# Altium project Cubli.PrjPcb (part 2 of 2)

## Sheet Power.SchDoc
size B; DocumentNumber: 4; SheetNumber: 2; SheetTotal: 7
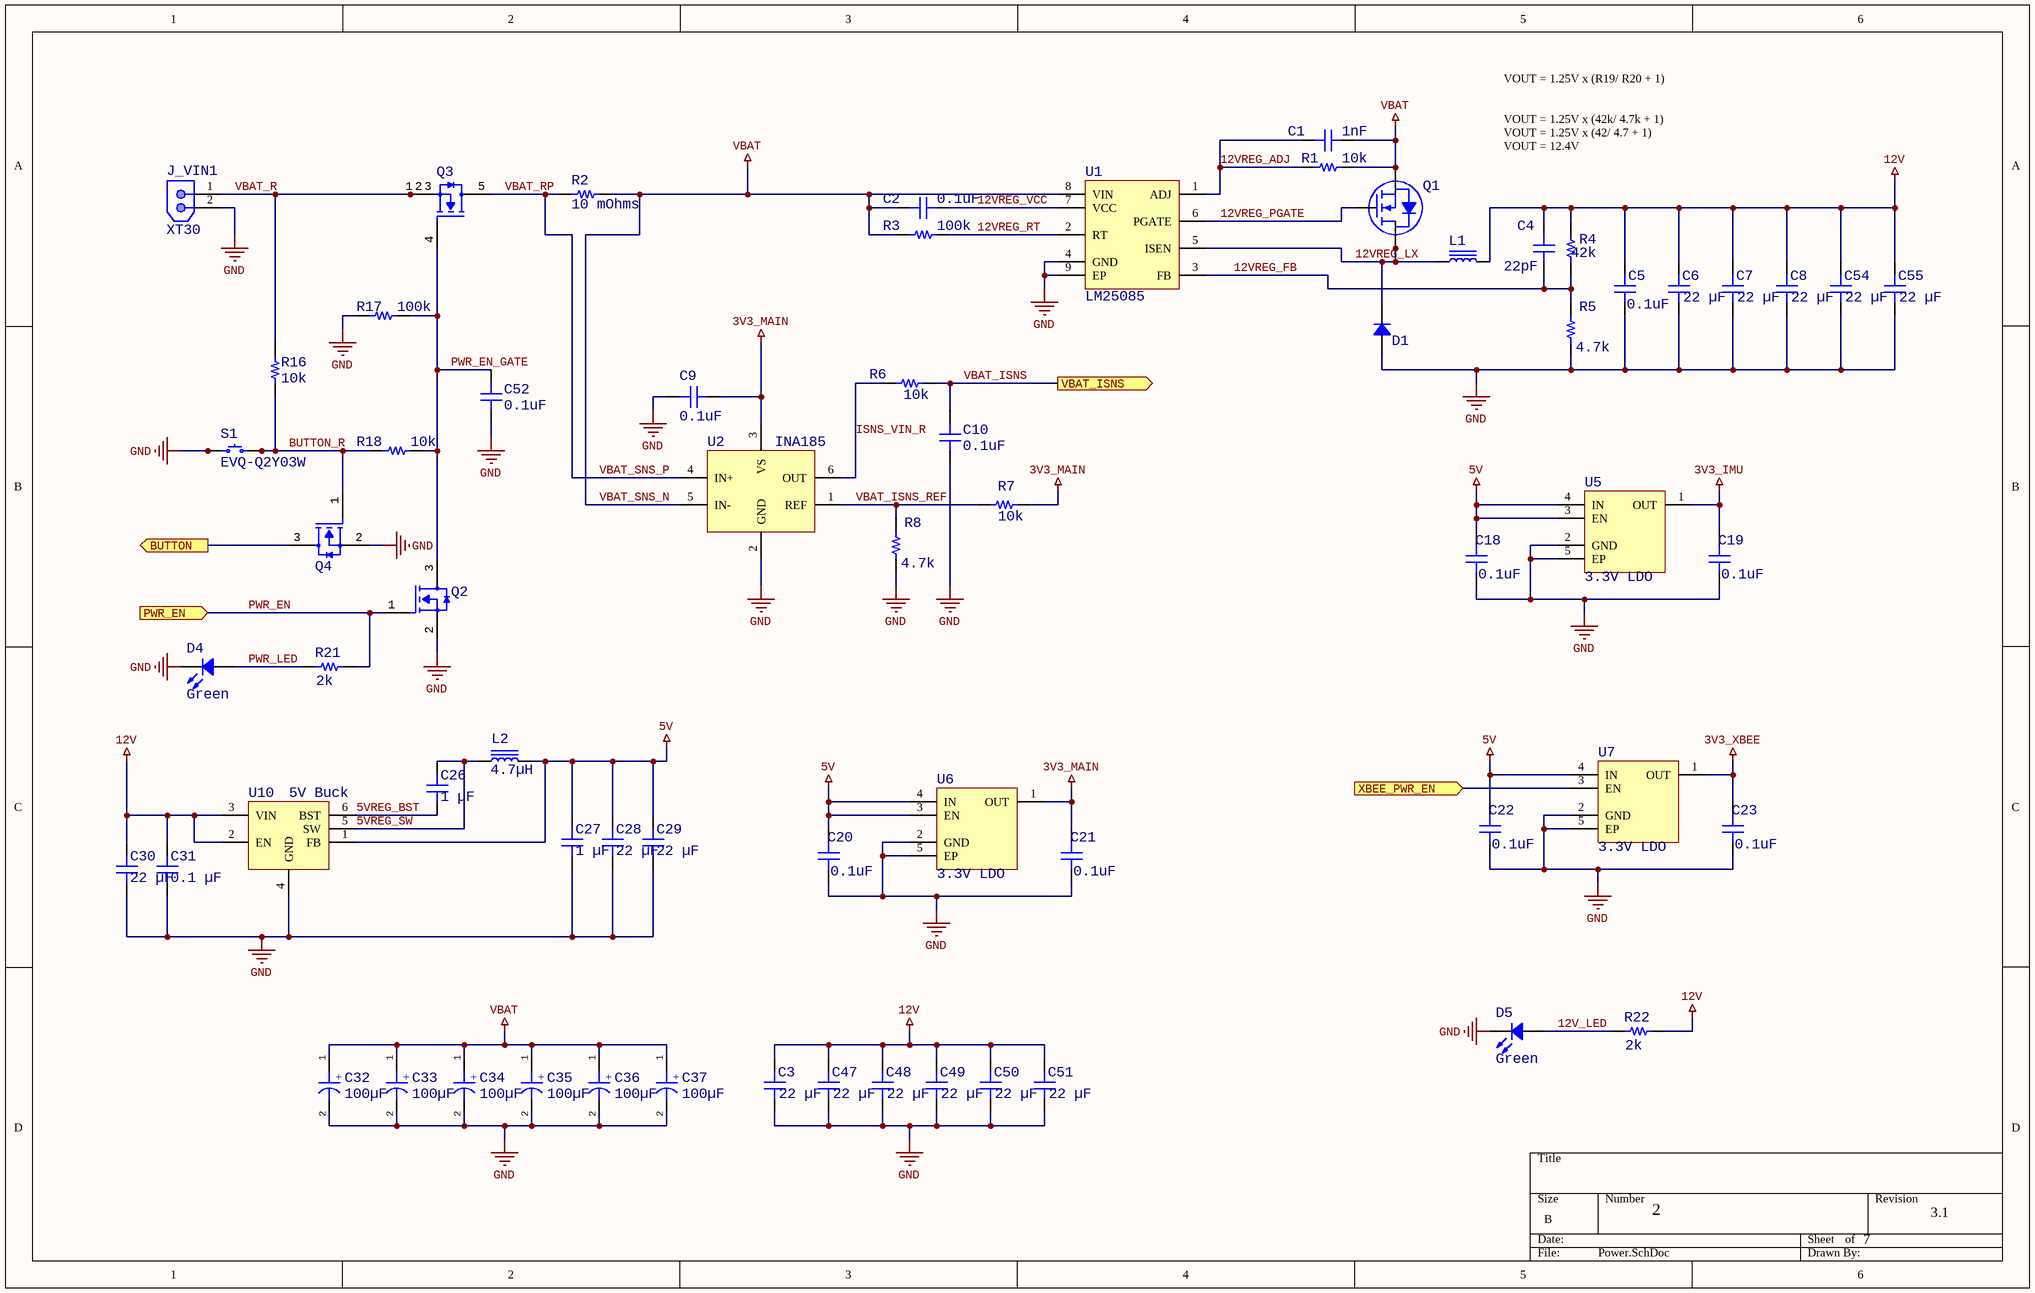
[diagram p6: Power.SchDoc]

### Parts
C1  1nF  [CAP_0402]
C2  0.1uF  [CAP_0402]
C3  22 µF  [CAP 0805_2012]
C4  22pF  [CAP_0402]
C5  0.1uF  [CAP_0402]
C6  22 µF  [CAP 0805_2012]
C7  22 µF  [CAP 0805_2012]
C8  22 µF  [CAP 0805_2012]
C9  0.1uF  [CAP_0402]
C10  0.1uF  [CAP_0402]
C18  0.1uF  [CAP_0402]
C19  0.1uF  [CAP_0402]
C20  0.1uF  [CAP_0402]
C21  0.1uF  [CAP_0402]
C22  0.1uF  [CAP_0402]
C23  0.1uF  [CAP_0402]
C26  1 µF  [CAP 0402_1005]
C27  1 µF  [CAP 0402_1005]
C28  22 µF  [CAP 0603_1608]
C29  22 µF  [CAP 0603_1608]
C30  22 µF  [CAP 0603_1608]
C31  0.1 µF  [CAP 0402_1005]
C32  value 100µF  [UWZ1V101MCL1GS]  (hidden comment: UWZ1V101MCL1GS)
C33  value 100µF  [UWZ1V101MCL1GS]  (hidden comment: UWZ1V101MCL1GS)
C34  value 100µF  [UWZ1V101MCL1GS]  (hidden comment: UWZ1V101MCL1GS)
C35  value 100µF  [UWZ1V101MCL1GS]  (hidden comment: UWZ1V101MCL1GS)
C36  value 100µF  [UWZ1V101MCL1GS]  (hidden comment: UWZ1V101MCL1GS)
C37  value 100µF  [UWZ1V101MCL1GS]  (hidden comment: UWZ1V101MCL1GS)
C47  22 µF  [CAP 0805_2012]
C48  22 µF  [CAP 0805_2012]
C49  22 µF  [CAP 0805_2012]
C50  22 µF  [CAP 0805_2012]
C51  22 µF  [CAP 0805_2012]
C52  0.1uF  [CAP_0402]
C54  22 µF  [CAP 0805_2012]
C55  22 µF  [CAP 0805_2012]
D1  SE10FGHM3/H  [SMF DO-219AB]  (value not drawn)
D4  Green  [LED 0603_1608 GREEN]
D5  Green  [LED 0603_1608 GREEN]
J_VIN1  XT30  [XT30]
L1  MPL-AL5050-5R6  [MPL-AL5050-5R6]  (value not drawn)
L2  4.7µH  [IND 1008_2520]
Q1  NVTFS5C680NL  [NVTFS015N04CTAG]  (value not drawn)
Q2  DMN61D9UWQ-7  [DMN61D9UWQ-7]  (value not drawn)
Q3  STL220N6F7  [STL220N6F7]  (value not drawn)
Q4  DMN61D9UWQ-7  [DMN61D9UWQ-7]  (value not drawn)
R1  10k  [RES_0402]
R2  10 mOhms  [RES 1206_3216]
R3  100k  [RES_0402]
R4  42k  [RES_0402]
R5  4.7k  [RES_0402]
R6  10k  [RES_0402]
R7  10k  [RES_0402]
R8  4.7k  [RES_0402]
R16  10k  [RES_0402]
R17  100k  [RES_0402]
R18  10k  [RES_0402]
R21  2k  [RES_0402]
R22  2k  [RES_0402]
S1  EVQ-Q2Y03W  [PANASONIC EVQQ2]
U1  LM25085  [8-WSON_3x3_0.5mm]
U2  INA185  [TI SC70-6 DCK]
U5  3.3V LDO  [XDFN-4]
U6  3.3V LDO  [XDFN-4]
U7  3.3V LDO  [XDFN-4]
U10  5V Buck  [TSOT-26-6 - 3.2mm]

### Ports
BUTTON (out), PWR_EN (in), VBAT_ISNS (out), XBEE_PWR_EN (in)

### Nets
3V3_IMU: C19.2 U5.1(OUT)
3V3_MAIN: C9.1 C21.2 R7.1 U2.3(VS) U6.1(OUT)
3V3_XBEE: C23.2 U7.1(OUT)
5V: C18.2 C20.2 C22.2 C27.2 C28.2 C29.2 L2.2 U5.3(EN) U5.4(IN) U6.3(EN) U6.4(IN) U7.4(IN) U10.1(FB)
12V: C3.2 C4.2 C5.2 C6.2 C7.2 C8.2 C30.2 C31.2 C47.2 C48.2 C49.2 C50.2 C51.2 C54.2 C55.2 L1.2 R4.1 R22.2 U10.2(EN) U10.3(VIN)
GND: C3.1 C5.1 C6.1 C7.1 C8.1 C9.2 C10.2 C18.1 C19.1 C20.1 C21.1 C22.1 C23.1 C27.1 C28.1 C29.1 C30.1 C31.1 C32.2 C33.2 C34.2 C35.2 C36.2 C37.2 C47.1 C48.1 C49.1 C50.1 C51.1 C52.2 C54.1 C55.1 D1.1 D4.2 D5.2 J_VIN1.2 Q2.2(SOURCE) Q4.2(SOURCE) R5.2 R8.2 R17.2 S1.1 S1.2 U1.4(GND) U1.9(EP) U2.2(GND) U5.2(GND) U5.5(EP) U6.2(GND) U6.5(EP) U7.2(GND) U7.5(EP) U10.4(GND)
VBAT: C1.2 C2.1 C32.1 C33.1 C34.1 C35.1 C36.1 C37.1 Q1.1(S) Q1.2(S) Q1.3(S) R1.1 R2.2 R3.2 U1.8(VIN) U2.5(IN-)  [also labelled VBAT_SNS_N]
5VREG_BST: C26.1 U10.6(BST)
5VREG_SW: C26.2 L2.1 U10.5(SW)
12V_LED: D5.1 R22.1
12VREG_ADJ: C1.1 R1.2 U1.1(ADJ)
12VREG_FB: C4.1 R4.2 R5.1 U1.3(FB)
12VREG_LX: D1.2 L1.1 Q1.5(D) Q1.6(D) Q1.7(D) Q1.8(D) U1.5(ISEN)
12VREG_PGATE: Q1.4(G) U1.6(PGATE)
12VREG_RT: R3.1 U1.2(RT)
12VREG_VCC: C2.2 U1.7(VCC)
BUTTON_IN: Q4.3(DRAIN) ; port BUTTON
BUTTON_R: Q4.1(GATE) R16.2 R18.2 S1.3 S1.4
ISNS_VIN_R: R6.2 U2.6(OUT)
PWR_EN: Q2.1(GATE) R21.2 ; port PWR_EN
PWR_EN_GATE: C52.1 Q2.3(DRAIN) Q3.4(GATE) R17.1 R18.1
PWR_LED: D4.1 R21.1
VBAT_ISNS: C10.1 R6.1 ; port VBAT_ISNS
VBAT_ISNS_REF: R7.2 R8.1 U2.1(REF)
VBAT_R: J_VIN1.1 Q3.1(SOURCE) Q3.2(SOURCE) Q3.3(SOURCE) R16.1
VBAT_RP: Q3.5(DRAIN) R2.1 U2.4(IN+)  [also labelled VBAT_SNS_P]
XBEE_PWR_EN: U7.3(EN) ; port XBEE_PWR_EN

### Notes on the sheet
- VOUT = 1.25V x (R19/ R20 + 1)
- VOUT = 1.25V x (42k/ 4.7k + 1)
  VOUT = 1.25V x (42/ 4.7 + 1)
  VOUT = 12.4V
- (in symbol CMP-001-00099-2) +

### Library data of the parts
C1 C2 C4 C5 C9 C10 C18-C23 C52 = CAP_0402: CAP CER 402
  C1: Value: 1nF
  C2 C5 C9 C10 C18-C23 C52: Value: 0.1uF
  C4: Value: 22pF
C3 C6-C8 C47-C51 C54 C55 = KGM21AS61C226MU: CAP CER 22UF 16V X6S 0805; manufacturer: KYOCERA AVX; Tolerance: ±20%; Part Number: KGM21AS61C226MU; Value: 22 µF; Applications: General Purpose; Capacitance: 22 µF; componentlink1description: Datasheet; componentlink1url: https://media.digikey.com/pdf/Data%20Sheets/AVX%20PDFs/CM03_CM05_CM105_CM21_CM316_Spec.pdf; componentlink2description: DigiKey Link; componentlink2url: https://www.digikey.com/en/products/detail/kyocera-avx/KGM21AS61C226MU/17827473; Device Package: 0805 (2012 Metric); lastupdated: 2/9/2024 8:14:12 PM; Lifecycle Status: Active; Minimum Order: 1; Mounting Type: Surface Mount, MLCC; Operating Temperature: -55°C ~ 105°C; Package / Case: 0805 (2012 Metric); packaging: TapeAndReel; partid: 52516; Part Status: Active; price: 0.12; series: KGM - X6S; Size / Dimension: 0.079" L x 0.049" W (2.01mm x 1.25mm); Supplier 1: DigiKey; Supplier Part Number 1: 478-KGM21AS61C226MUCT-ND; Temperature Coefficient: X6S; Thickness (Max): 0.057" (1.45mm); Voltage - Rated: 16V
C26 C27 = C0402C104K4RACAUTO: CAP CER 0.1UF 16V X7R 0402; manufacturer: KEMET; Capacitance: 0.1 µF; Tolerance: ±10%; Part Number: C0402C104K4RACAUTO; Value: 1 µF; Applications: Automotive, Bypass, Decoupling; componentlink1description: Datasheet; componentlink1url: https://api.kemet.com/component-edge/download/specsheet/C0402C104K4RACAUTO.pdf; componentlink2description: DigiKey Link; componentlink2url: https://www.digikey.com/en/products/detail/kemet/C0402C104K4RACAUTO/3314827; Device Package: 0402 (1005 Metric); lastupdated: 2/9/2024 8:04:35 PM; Lifecycle Status: Active; Minimum Order: 1; Mounting Type: Surface Mount, MLCC; Operating Temperature: -55°C ~ 125°C; Package / Case: 0402 (1005 Metric); packaging: TapeAndReel; partid: 3024; Part Status: Active; price: 0.01; Ratings: AEC-Q200; series: SMD Auto X7R; Size / Dimension: 0.039" L x 0.020" W (1.00mm x 0.50mm); Supplier 1: DigiKey; Supplier Part Number 1: 399-6828-1-ND; Temperature Coefficient: X7R; Thickness (Max): 0.022" (0.55mm); Voltage - Rated: 16V
C28-C30 = C0603B476M007T: CAP CER 47UF 6.3V X5R 0603; manufacturer: Holy Stone Enterprise Co., Ltd.; Capacitance: 47 µF; Tolerance: ±20%; Part Number: C0603B476M007T; Value: 22 µF; Applications: SMPS Filtering; componentlink1description: Datasheet; componentlink1url: https://media.digikey.com/pdf/Data%20Sheets/Holy%20Stone/HCC_Series_DS.pdf; componentlink2description: DigiKey Link; componentlink2url: https://www.digikey.com/en/products/detail/holy-stone-enterprise-co-ltd/C0603B476M007T/16895203; Device Package: 0603 (1608 Metric); lastupdated: 2/9/2024 8:09:41 PM; Lifecycle Status: Active; Minimum Order: 1; Mounting Type: Surface Mount, MLCC; Operating Temperature: -55°C ~ 85°C; Package / Case: 0603 (1608 Metric); packaging: TapeAndReel; partid: 48531; Part Status: Active; price: 0.12; series: HCC; Size / Dimension: 0.063" L x 0.031" W (1.60mm x 0.80mm); Supplier 1: DigiKey; Supplier Part Number 1: 4587-C0603B476M007TCT-ND; Temperature Coefficient: X5R; Thickness (Max): 0.039" (1.00mm); Voltage - Rated: 6.3V
C31 = C0402C104K4RACAUTO: CAP CER 0.1UF 16V X7R 0402; manufacturer: KEMET; Tolerance: ±10%; Part Number: C0402C104K4RACAUTO; Value: 0.1 µF; Applications: Automotive, Bypass, Decoupling; Capacitance: 0.1 µF; componentlink1description: Datasheet; componentlink1url: https://api.kemet.com/component-edge/download/specsheet/C0402C104K4RACAUTO.pdf; componentlink2description: DigiKey Link; componentlink2url: https://www.digikey.com/en/products/detail/kemet/C0402C104K4RACAUTO/3314827; Device Package: 0402 (1005 Metric); lastupdated: 2/9/2024 8:04:35 PM; Lifecycle Status: Active; Minimum Order: 1; Mounting Type: Surface Mount, MLCC; Operating Temperature: -55°C ~ 125°C; Package / Case: 0402 (1005 Metric); packaging: TapeAndReel; partid: 3024; Part Status: Active; price: 0.01; Ratings: AEC-Q200; series: SMD Auto X7R; Size / Dimension: 0.039" L x 0.020" W (1.00mm x 0.50mm); Supplier 1: DigiKey; Supplier Part Number 1: 399-6828-1-ND; Temperature Coefficient: X7R; Thickness (Max): 0.022" (0.55mm); Voltage - Rated: 16V
C32-C37 = CMP-001-00099-2: Aluminum Electrolytic Capacitor, Polarized, Aluminum (wet), 35V, 20% +Tol, 20% -Tol, 100uF, Surface Mount, 2626; Capacitor Type: Aluminium; AECQ: Yes; Ripple Current: 84mA; Case/Package: 6.60mm x 6.60mm; Voltage Rating: 35V; Min Operating Temperature: -55°C; Mounting Technology: Surface Mount; Max Operating Temperature: 105°C; RoHS Compliant: Yes; Pins: 2
D1 = SE10FGHM3/H: DIODE GEN PURP 400V 1A DO219AB; Manufacturer: Vishay Semiconductor Diodes Division; Capacitance @ Vr, F: 7.5pF @ 4V, 1MHz; Current - Reverse Leakage @ Vr: 5µA @ 400V; Diode Type: Standard; Reverse Recovery Time (trr): 780ns; Speed: Standard Recovery >500ns, > 200mA (Io); Voltage - Forward (Vf) (Max) @ If: 1.05V @ 1A; Part Number: SE10FGHM3/H; ComponentLink1Description: Datasheet; ComponentLink1URL: http://www.vishay.com/docs/87722/se10fd-se10fg-se10fj.pdf; ComponentLink2Description: DigiKey Link; ComponentLink2URL: http://digikey.com/product-detail/en/vishay-semiconductor-diodes-division/SE10FGHM3-H/SE10FGHM3-HGICT-ND/8565217; Current - Average Rectified (Io): 1A; LastUpdated: 6/3/2024 8:05:29 PM; Lifecycle Status: Active; Minimum Order: 1; Mounting Type: Surface Mount; Operating Temperature - Junction: -55°C ~ 175°C; Package / Case: DO-219AB; Packaging: TapeAndReel; PartId: 1227; Part Status: Active; Price: 0.10; Series: Automotive, AEC-Q101; Supplier 1: DigiKey; Supplier Part Number 1: SE10FGHM3/HGICT-ND; Supplier Device Package: DO-219AB (SMF); Voltage - DC Reverse (Vr) (Max): 400V
D4 D5 = XZCDGK53W-8VF: LED GREEN CLEAR 2SMD; Manufacturer: SunLED; Configuration: Independent; Current - Test: 2mA; Lens Color: Colorless; Lens Size: 0.35mm Dia; Lens Style: Round with Domed Top; Millicandela Rating: 417mcd; Viewing Angle: 60°; Voltage - Forward (Vf) (Typ): 2.65V; Wavelength - Dominant: 525nm; Wavelength - Peak: 515nm; Part Number: XZCDGK53W-8VF; Color: Green; ComponentLink1Description: Datasheet; ComponentLink1URL: https://www.sunledusa.com/products/spec/XZCDGK53W-8VF.pdf; ComponentLink2Description: DigiKey Link; ComponentLink2URL: https://www.digikey.com/en/products/detail/sunled/XZCDGK53W-8VF/10449775; Device Package: 0603 (1608 Metric); Height (Max): 1.10mm; LastUpdated: 6/3/2024 7:58:52 PM; Lens Transparency: Clear; Lifecycle Status: Active; Minimum Order: 1; Mounting Type: Surface Mount; Package / Case: 0603 (1608 Metric); Packaging: TapeAndReel; PartId: 938; Part Status: Active; Price: 0.15; Series: Ultra Low Current; Size / Dimension: 1.60mm L x 0.80mm W; Supplier 1: DigiKey; Supplier Part Number 1: 1497-XZCDGK53W-8VFCT-ND; Supplier Device Package: 2-SMD; Value: Green
L1 = MPL-AL5050-5R6: FIXED IND 5.6UH 6.8A 20 MOHM SMD; MF: Laird-Signal Integrity Products; MP: MGV05021R0M-10; SnapEDA_Link: https://www.snapeda.com/parts/MGV05021R0M-10/Laird/view-part/5881352/?ref=snap; Availability: In Stock; Purchase-URL: https://pricing.snapeda.com/search/part/MGV05021R0M-10/?ref=eda; Check_prices: https://www.snapeda.com/parts/MGV05021R0M-10/Laird/view-part/5881352/?ref=eda; Value: *; Package: Molded-2 Laird; Price: None
L2 = MLP2520S4R7ST0S1: FIXED IND 4.7UH 1A 110 MOHM SMD; Manufacturer: TDK Corporation; DC Resistance (DCR): 143mOhm Max; Inductance Frequency - Test: 2MHz; Material - Core: Ferrite; Shielding: Shielded; Tolerance: ±20%; Type: Multilayer; Part Number: MLP2520S4R7ST0S1; ComponentLink1Description: Datasheet; ComponentLink1URL: https://product.tdk.com/info/en/catalog/datasheets/inductor_commercial_power_mlp2520_en.pdf?ref_disty=digikey; ComponentLink2Description: DigiKey Link; ComponentLink2URL: http://digikey.com/product-detail/en/tdk-corporation/MLP2520S4R7ST0S1/445-6378-1-ND/2465705; Current Rating (Amps): 1A; Device Package: 1008 (2520 Metric); Height - Seated (Max): 0.039" (1.00mm); Inductance: 4.7µH; LastUpdated: 9/2/2020 1:29:23 AM; Lifecycle Status: Active; Minimum Order: 1; Mounting Type: Surface Mount; Operating Temperature: -40°C ~ 125°C; Package / Case: 1008 (2520 Metric); Packaging: TapeAndReel; PartId: 3467; Part Status: Active; Price: 0.14; Series: MLP; Size / Dimension: 0.098" L x 0.079" W (2.50mm x 2.00mm); Supplier 1: DigiKey; Supplier Part Number 1: 445-6378-1-ND; Supplier Device Package: 1008 (2520 Metric); Value: 4.7µH
Q1 = NVTFS5C680NL: N-FET
Q2 Q4 = CMP-013-00037-2: Small Signal Field-Effect Transistor; Transistor Type: n-FET; Min Operating Temperature: -55°C; Max Operating Temperature: 175°C; RoHS Compliant: Yes
Q3 = CMP-013-00035-1: Power Field-Effect Transistor, 120A I(D), 60V, 0.0014ohm, 1-Element, N-Channel, Silicon, Metal-oxide Semiconductor FET; Transistor Type: n-FET; Power: 4.8W; Min Operating Temperature: -55°C; Pins: 8; Case/Package: 8-PowerVDFN; RoHS Compliant: Yes; Max Operating Temperature: 175°C
R1 R3-R8 R16-R18 R21 R22 = RES_0402: RES 0402
R2 = KRL1632E-M-R039-F-T5: RES 0.039 OHM 1% 3/4W 1206; Manufacturer: Susumu; Power (Watts): 0.75W, 3/4W; Resistance: 39 mOhms; Temperature Coefficient: ±50ppm/°C; Value: 39 mOhms; Part Number: KRL1632E-M-R039-F-T5; ComponentLink1Description: Datasheet; ComponentLink1URL: http://www.susumu.co.jp/common/pdf/n_catalog_partition09_en.pdf; ComponentLink2Description: DigiKey Link; ComponentLink2URL: https://www.digikey.com/en/products/detail/susumu/KRL1632E-M-R039-F-T5/3738003; Composition: Metal Foil; Device Package: 1206 (3216 Metric); Features: Automotive AEC-Q200, Current Sense; Height - Seated (Max): 0.028" (0.70mm); LastUpdated: 2/9/2024 8:54:46 PM; Lifecycle Status: Active; Minimum Order: 1; Number of Terminations: 2; Operating Temperature: -55°C ~ 155°C; Package / Case: 1206 (3216 Metric); Packaging: TapeAndReel; PartId: 26838; Part Status: Active; Price: 0.09; Ratings: AEC-Q200; Series: KRL; Size / Dimension: 0.126" L x 0.063" W (3.20mm x 1.60mm); Supplier 1: DigiKey; Supplier Part Number 1: 408-1577-1-ND; Supplier Device Package: 1206; Tolerance: ±1%
S1 = EVQ-Q2Y03W: SWITCH TACTILE SPST-NO 0.02A 15V; Manufacturer: Panasonic Electronic Components; Actuator Height off PCB, Vertical: 3.10mm; Actuator Orientation: Top Actuated; Actuator Type: Standard; Contact Rating @ Voltage: 0.02A @ 15VDC; Illumination: Non-Illuminated; Operating Force: 350gf; Outline: 6.50mm x 6.00mm; Switch Function: Off-Mom; Part Number: EVQ-Q2Y03W; Circuit: SPST-NO; ComponentLink1Description: Datasheet; ComponentLink1URL: https://industrial.panasonic.com/ac/cdn/e/control/switch/light-touch/catalog/sw_lt_eng_6s_th.pdf; ComponentLink2Description: DigiKey Link; ComponentLink2URL: http://digikey.com/product-detail/en/panasonic-electronic-components/EVQ-Q2Y03W/P12961SCT-ND/762951; LastUpdated: 4/9/2020 9:55:13 AM; Lifecycle Status: Active; Minimum Order: 1; Mounting Type: Surface Mount; Operating Temperature: -40°C ~ 85°C; Packaging: TapeAndReel; Part Status: Active; Price: 0.16; Series: EVQQ2; Supplier 1: DigiKey; Supplier Part Number 1: P12961SCT-ND; Termination Style: J Lead
U1 = LM25085: PFET Buck Controller
U2 = INA185: INA185A2
U5-U7 = TLV74033PDQNR
U10 = AP63205WU-7: 5V fixed step down Buck

## Nets that join several sheets
3V3_IMU: Top (10 pins), Power (C19.2 U5.1)
3V3_MAIN: Top (R9.1 R10.1 U9.5), Main_MCU (16 pins), Power (5 pins)
3V3_XBEE: Top (C25.1 U8.2), Power (C23.2 U7.1)
5V: Top (C24.1 J_I2C.1 U9.3), U_ESC1 (C26_ESC_1.1 R8_ESC_1.2 R38_ESC_1.2 U7_ESC_1.3), U_ESC1/U_Power (6 pins), U_ESC2 (C26_ESC_2.1 R8_ESC_2.2 R38_ESC_2.2 U7_ESC_2.3), U_ESC2/U_Power (6 pins), U_ESC3 (C26_ESC_3.1 R8_ESC_3.2 R38_ESC_3.2 U7_ESC_3.3), U_ESC3/U_Power (6 pins), Power (13 pins)
12V: U_ESC1/U_Half_Bridges (15 pins), U_ESC2/U_Half_Bridges (15 pins), U_ESC3/U_Half_Bridges (15 pins), Power (20 pins)
GND: Top (29 pins), U_ESC1 (23 pins), U_ESC1/U_ESC_MCU (20 pins), U_ESC1/U_Power (28 pins), U_ESC1/U_Half_Bridges (38 pins), U_ESC2 (23 pins), U_ESC2/U_ESC_MCU (20 pins), U_ESC2/U_Power (28 pins), U_ESC2/U_Half_Bridges (38 pins), U_ESC3 (23 pins), U_ESC3/U_ESC_MCU (20 pins), U_ESC3/U_Power (28 pins), U_ESC3/U_Half_Bridges (38 pins), Main_MCU (21 pins), Power (53 pins)
VBAT: Top (R23.1), U_ESC1/U_Power (R1_ESC_1.1 U1_ESC_1.4), U_ESC2/U_Power (R1_ESC_2.1 U1_ESC_2.4), U_ESC3/U_Power (R1_ESC_3.1 U1_ESC_3.4), Power (16 pins)
3V3_LOGIC_ESC_U_ESC1: U_ESC1 (R7_ESC_1.2), U_ESC1/U_Power (5 pins), U_ESC1/U_Half_Bridges (6 pins)
3V3_LOGIC_ESC_U_ESC2: U_ESC2 (R7_ESC_2.2), U_ESC2/U_Power (5 pins), U_ESC2/U_Half_Bridges (6 pins)
3V3_LOGIC_ESC_U_ESC3: U_ESC3 (R7_ESC_3.2), U_ESC3/U_Power (5 pins), U_ESC3/U_Half_Bridges (6 pins)
3V3_MCU_ESC_U_ESC1: U_ESC1 (8 pins), U_ESC1/U_ESC_MCU (15 pins), U_ESC1/U_Power (C12_ESC_1.2 U2_ESC_1.1)
3V3_MCU_ESC_U_ESC2: U_ESC2 (8 pins), U_ESC2/U_ESC_MCU (15 pins), U_ESC2/U_Power (C12_ESC_2.2 U2_ESC_2.1)
3V3_MCU_ESC_U_ESC3: U_ESC3 (8 pins), U_ESC3/U_ESC_MCU (15 pins), U_ESC3/U_Power (C12_ESC_3.2 U2_ESC_3.1)
BRAKE_MOTOR_IN1_U_ESC1: U_ESC1 (U14_ESC_1.6), U_ESC1/U_ESC_MCU (U13_ESC_1.41)
BRAKE_MOTOR_IN1_U_ESC2: U_ESC2 (U14_ESC_2.6), U_ESC2/U_ESC_MCU (U13_ESC_2.41)
BRAKE_MOTOR_IN1_U_ESC3: U_ESC3 (U14_ESC_3.6), U_ESC3/U_ESC_MCU (U13_ESC_3.41)
BRAKE_MOTOR_IN2_U_ESC1: U_ESC1 (U14_ESC_1.5), U_ESC1/U_ESC_MCU (U13_ESC_1.40)
BRAKE_MOTOR_IN2_U_ESC2: U_ESC2 (U14_ESC_2.5), U_ESC2/U_ESC_MCU (U13_ESC_2.40)
BRAKE_MOTOR_IN2_U_ESC3: U_ESC3 (U14_ESC_3.5), U_ESC3/U_ESC_MCU (U13_ESC_3.40)
BUTTON_IN: Main_MCU (R20.2), Power (Q4.3)
CAN_H: Top (R11.2 U9.7), U_ESC1 (R9_ESC_1.2 U7_ESC_1.7), U_ESC2 (R9_ESC_2.2 U7_ESC_2.7), U_ESC3 (R9_ESC_3.2 U7_ESC_3.7)
CAN_L: Top (R11.1 U9.6), U_ESC1 (R9_ESC_1.1 U7_ESC_1.6), U_ESC2 (R9_ESC_2.1 U7_ESC_2.6), U_ESC3 (R9_ESC_3.1 U7_ESC_3.6)
CAN_RX: Top (U9.4), Main_MCU (U11.47)
CAN_RX_U_ESC1: U_ESC1 (U7_ESC_1.4), U_ESC1/U_ESC_MCU (U13_ESC_1.47)
CAN_RX_U_ESC2: U_ESC2 (U7_ESC_2.4), U_ESC2/U_ESC_MCU (U13_ESC_2.47)
CAN_RX_U_ESC3: U_ESC3 (U7_ESC_3.4), U_ESC3/U_ESC_MCU (U13_ESC_3.47)
CAN_S: Top (U9.8), Main_MCU (U11.2)
CAN_S_U_ESC1: U_ESC1 (U7_ESC_1.8), U_ESC1/U_ESC_MCU (U13_ESC_1.2)
CAN_S_U_ESC2: U_ESC2 (U7_ESC_2.8), U_ESC2/U_ESC_MCU (U13_ESC_2.2)
CAN_S_U_ESC3: U_ESC3 (U7_ESC_3.8), U_ESC3/U_ESC_MCU (U13_ESC_3.2)
CAN_TX: Top (U9.1), Main_MCU (U11.48)
CAN_TX_U_ESC1: U_ESC1 (U7_ESC_1.1), U_ESC1/U_ESC_MCU (U13_ESC_1.48)
CAN_TX_U_ESC2: U_ESC2 (U7_ESC_2.1), U_ESC2/U_ESC_MCU (U13_ESC_2.48)
CAN_TX_U_ESC3: U_ESC3 (U7_ESC_3.1), U_ESC3/U_ESC_MCU (U13_ESC_3.48)
COMP_OUT_U_U_ESC1: U_ESC1 (U5_ESC_1.15), U_ESC1/U_ESC_MCU (U13_ESC_1.64)
COMP_OUT_U_U_ESC2: U_ESC2 (U5_ESC_2.15), U_ESC2/U_ESC_MCU (U13_ESC_2.64)
COMP_OUT_U_U_ESC3: U_ESC3 (U5_ESC_3.15), U_ESC3/U_ESC_MCU (U13_ESC_3.64)
COMP_OUT_V_U_ESC1: U_ESC1 (U5_ESC_1.16), U_ESC1/U_ESC_MCU (U13_ESC_1.63)
COMP_OUT_V_U_ESC2: U_ESC2 (U5_ESC_2.16), U_ESC2/U_ESC_MCU (U13_ESC_2.63)
COMP_OUT_V_U_ESC3: U_ESC3 (U5_ESC_3.16), U_ESC3/U_ESC_MCU (U13_ESC_3.63)
COMP_OUT_W_U_ESC1: U_ESC1 (U5_ESC_1.14), U_ESC1/U_ESC_MCU (U13_ESC_1.65)
COMP_OUT_W_U_ESC2: U_ESC2 (U5_ESC_2.14), U_ESC2/U_ESC_MCU (U13_ESC_2.65)
COMP_OUT_W_U_ESC3: U_ESC3 (U5_ESC_3.14), U_ESC3/U_ESC_MCU (U13_ESC_3.65)
ENC_PWR_EN_U_ESC1: U_ESC1 (U6_ESC_1.5), U_ESC1/U_ESC_MCU (U13_ESC_1.3)
ENC_PWR_EN_U_ESC2: U_ESC2 (U6_ESC_2.5), U_ESC2/U_ESC_MCU (U13_ESC_2.3)
ENC_PWR_EN_U_ESC3: U_ESC3 (U6_ESC_3.5), U_ESC3/U_ESC_MCU (U13_ESC_3.3)
IMU_INT: Top (R15.2 U4.12), Main_MCU (U11.63)
ISNS_V_U_ESC1: U_ESC1/U_ESC_MCU (U13_ESC_1.16), U_ESC1/U_Half_Bridges (C40_ESC_1.1 R26_ESC_1.1)
ISNS_V_U_ESC2: U_ESC2/U_ESC_MCU (U13_ESC_2.16), U_ESC2/U_Half_Bridges (C40_ESC_2.1 R26_ESC_2.1)
ISNS_V_U_ESC3: U_ESC3/U_ESC_MCU (U13_ESC_3.16), U_ESC3/U_Half_Bridges (C40_ESC_3.1 R26_ESC_3.1)
ISNS_VIN_U_ESC1: U_ESC1/U_ESC_MCU (U13_ESC_1.8), U_ESC1/U_Power (C2_ESC_1.1 R2_ESC_1.1)
ISNS_VIN_U_ESC2: U_ESC2/U_ESC_MCU (U13_ESC_2.8), U_ESC2/U_Power (C2_ESC_2.1 R2_ESC_2.1)
ISNS_VIN_U_ESC3: U_ESC3/U_ESC_MCU (U13_ESC_3.8), U_ESC3/U_Power (C2_ESC_3.1 R2_ESC_3.1)
ISNS_W_U_ESC1: U_ESC1/U_ESC_MCU (U13_ESC_1.15), U_ESC1/U_Half_Bridges (C41_ESC_1.1 R27_ESC_1.1)
ISNS_W_U_ESC2: U_ESC2/U_ESC_MCU (U13_ESC_2.15), U_ESC2/U_Half_Bridges (C41_ESC_2.1 R27_ESC_2.1)
ISNS_W_U_ESC3: U_ESC3/U_ESC_MCU (U13_ESC_3.15), U_ESC3/U_Half_Bridges (C41_ESC_3.1 R27_ESC_3.1)
MCU_TO_XBEE: Top (U8.4), Main_MCU (U11.29)
OUT_U_U_ESC1: U_ESC1 (J1_ESC_1.1), U_ESC1/U_Half_Bridges (10 pins)
OUT_U_U_ESC2: U_ESC2 (J1_ESC_2.1), U_ESC2/U_Half_Bridges (10 pins)
OUT_U_U_ESC3: U_ESC3 (J1_ESC_3.1), U_ESC3/U_Half_Bridges (10 pins)
OUT_V_U_ESC1: U_ESC1 (J1_ESC_1.2), U_ESC1/U_Half_Bridges (R13_ESC_1.2 R21_ESC_1.1 U11_ESC_1.4)
OUT_V_U_ESC2: U_ESC2 (J1_ESC_2.2), U_ESC2/U_Half_Bridges (R13_ESC_2.2 R21_ESC_2.1 U11_ESC_2.4)
OUT_V_U_ESC3: U_ESC3 (J1_ESC_3.2), U_ESC3/U_Half_Bridges (R13_ESC_3.2 R21_ESC_3.1 U11_ESC_3.4)
OUT_W_U_ESC1: U_ESC1 (J1_ESC_1.3), U_ESC1/U_Half_Bridges (R14_ESC_1.2 R23_ESC_1.1 U12_ESC_1.4)
OUT_W_U_ESC2: U_ESC2 (J1_ESC_2.3), U_ESC2/U_Half_Bridges (R14_ESC_2.2 R23_ESC_2.1 U12_ESC_2.4)
OUT_W_U_ESC3: U_ESC3 (J1_ESC_3.3), U_ESC3/U_Half_Bridges (R14_ESC_3.2 R23_ESC_3.1 U12_ESC_3.4)
PWM_UH_U_ESC1: U_ESC1/U_ESC_MCU (U13_ESC_1.44), U_ESC1/U_Half_Bridges (U8_ESC_1.7)
PWM_UH_U_ESC2: U_ESC2/U_ESC_MCU (U13_ESC_2.44), U_ESC2/U_Half_Bridges (U8_ESC_2.7)
PWM_UH_U_ESC3: U_ESC3/U_ESC_MCU (U13_ESC_3.44), U_ESC3/U_Half_Bridges (U8_ESC_3.7)
PWM_UL_U_ESC1: U_ESC1/U_ESC_MCU (U13_ESC_1.35), U_ESC1/U_Half_Bridges (U8_ESC_1.8)
PWM_UL_U_ESC2: U_ESC2/U_ESC_MCU (U13_ESC_2.35), U_ESC2/U_Half_Bridges (U8_ESC_2.8)
PWM_UL_U_ESC3: U_ESC3/U_ESC_MCU (U13_ESC_3.35), U_ESC3/U_Half_Bridges (U8_ESC_3.8)
PWM_VH_U_ESC1: U_ESC1/U_ESC_MCU (U13_ESC_1.45), U_ESC1/U_Half_Bridges (U9_ESC_1.7)
PWM_VH_U_ESC2: U_ESC2/U_ESC_MCU (U13_ESC_2.45), U_ESC2/U_Half_Bridges (U9_ESC_2.7)
PWM_VH_U_ESC3: U_ESC3/U_ESC_MCU (U13_ESC_3.45), U_ESC3/U_Half_Bridges (U9_ESC_3.7)
PWM_VL_U_ESC1: U_ESC1/U_ESC_MCU (U13_ESC_1.26), U_ESC1/U_Half_Bridges (U9_ESC_1.8)
PWM_VL_U_ESC2: U_ESC2/U_ESC_MCU (U13_ESC_2.26), U_ESC2/U_Half_Bridges (U9_ESC_2.8)
PWM_VL_U_ESC3: U_ESC3/U_ESC_MCU (U13_ESC_3.26), U_ESC3/U_Half_Bridges (U9_ESC_3.8)
PWM_WH_U_ESC1: U_ESC1/U_ESC_MCU (U13_ESC_1.46), U_ESC1/U_Half_Bridges (U10_ESC_1.7)
PWM_WH_U_ESC2: U_ESC2/U_ESC_MCU (U13_ESC_2.46), U_ESC2/U_Half_Bridges (U10_ESC_2.7)
PWM_WH_U_ESC3: U_ESC3/U_ESC_MCU (U13_ESC_3.46), U_ESC3/U_Half_Bridges (U10_ESC_3.7)
PWM_WL_U_ESC1: U_ESC1/U_ESC_MCU (U13_ESC_1.27), U_ESC1/U_Half_Bridges (U10_ESC_1.8)
PWM_WL_U_ESC2: U_ESC2/U_ESC_MCU (U13_ESC_2.27), U_ESC2/U_Half_Bridges (U10_ESC_2.8)
PWM_WL_U_ESC3: U_ESC3/U_ESC_MCU (U13_ESC_3.27), U_ESC3/U_Half_Bridges (U10_ESC_3.8)
PWR_EN: Main_MCU (U11.16), Power (Q2.1 R21.2)
SERVO_U_ESC1: U_ESC1 (J3_ESC_1.3), U_ESC1/U_ESC_MCU (U13_ESC_1.56)
SERVO_U_ESC2: U_ESC2 (J3_ESC_2.3), U_ESC2/U_ESC_MCU (U13_ESC_2.56)
SERVO_U_ESC3: U_ESC3 (J3_ESC_3.3), U_ESC3/U_ESC_MCU (U13_ESC_3.56)
V_ESC_U_ESC1: U_ESC1 (R5_ESC_1.2 R37_ESC_1.2), U_ESC1/U_Power (18 pins), U_ESC1/U_Half_Bridges (12 pins)
V_ESC_U_ESC2: U_ESC2 (R5_ESC_2.2 R37_ESC_2.2), U_ESC2/U_Power (18 pins), U_ESC2/U_Half_Bridges (12 pins)
V_ESC_U_ESC3: U_ESC3 (R5_ESC_3.2 R37_ESC_3.2), U_ESC3/U_Power (18 pins), U_ESC3/U_Half_Bridges (12 pins)
VBAT_ISNS: Main_MCU (U11.14), Power (C10.1 R6.1)
VSNS_ESC_U_ESC1: U_ESC1 (C23_ESC_1.2 D1_ESC_1.2 R5_ESC_1.1 R6_ESC_1.1), U_ESC1/U_ESC_MCU (U13_ESC_1.9)
VSNS_ESC_U_ESC2: U_ESC2 (C23_ESC_2.2 D1_ESC_2.2 R5_ESC_2.1 R6_ESC_2.1), U_ESC2/U_ESC_MCU (U13_ESC_2.9)
VSNS_ESC_U_ESC3: U_ESC3 (C23_ESC_3.2 D1_ESC_3.2 R5_ESC_3.1 R6_ESC_3.1), U_ESC3/U_ESC_MCU (U13_ESC_3.9)
VSNS_U_U_ESC1: U_ESC1 (U5_ESC_1.6), U_ESC1/U_ESC_MCU (U13_ESC_1.24), U_ESC1/U_Half_Bridges (5 pins)
VSNS_U_U_ESC2: U_ESC2 (U5_ESC_2.6), U_ESC2/U_ESC_MCU (U13_ESC_2.24), U_ESC2/U_Half_Bridges (5 pins)
VSNS_U_U_ESC3: U_ESC3 (U5_ESC_3.6), U_ESC3/U_ESC_MCU (U13_ESC_3.24), U_ESC3/U_Half_Bridges (5 pins)
VSNS_V_U_ESC1: U_ESC1 (U5_ESC_1.4), U_ESC1/U_ESC_MCU (U13_ESC_1.25), U_ESC1/U_Half_Bridges (5 pins)
VSNS_V_U_ESC2: U_ESC2 (U5_ESC_2.4), U_ESC2/U_ESC_MCU (U13_ESC_2.25), U_ESC2/U_Half_Bridges (5 pins)
VSNS_V_U_ESC3: U_ESC3 (U5_ESC_3.4), U_ESC3/U_ESC_MCU (U13_ESC_3.25), U_ESC3/U_Half_Bridges (5 pins)
VSNS_VBAT: Top (C56.1 R23.2 R24.1), Main_MCU (U11.15)
VSNS_W_U_ESC1: U_ESC1 (U5_ESC_1.8), U_ESC1/U_ESC_MCU (U13_ESC_1.17), U_ESC1/U_Half_Bridges (5 pins)
VSNS_W_U_ESC2: U_ESC2 (U5_ESC_2.8), U_ESC2/U_ESC_MCU (U13_ESC_2.17), U_ESC2/U_Half_Bridges (5 pins)
VSNS_W_U_ESC3: U_ESC3 (U5_ESC_3.8), U_ESC3/U_ESC_MCU (U13_ESC_3.17), U_ESC3/U_Half_Bridges (5 pins)
VSNS_X_U_ESC1: U_ESC1 (U5_ESC_1.2 U5_ESC_1.5 U5_ESC_1.7), U_ESC1/U_ESC_MCU (U13_ESC_1.11), U_ESC1/U_Half_Bridges (R18_ESC_1.2 R20_ESC_1.2 R22_ESC_1.2)
VSNS_X_U_ESC2: U_ESC2 (U5_ESC_2.2 U5_ESC_2.5 U5_ESC_2.7), U_ESC2/U_ESC_MCU (U13_ESC_2.11), U_ESC2/U_Half_Bridges (R18_ESC_2.2 R20_ESC_2.2 R22_ESC_2.2)
VSNS_X_U_ESC3: U_ESC3 (U5_ESC_3.2 U5_ESC_3.5 U5_ESC_3.7), U_ESC3/U_ESC_MCU (U13_ESC_3.11), U_ESC3/U_Half_Bridges (R18_ESC_3.2 R20_ESC_3.2 R22_ESC_3.2)
XBEE_PWR_EN: Main_MCU (U11.24), Power (U7.3)
XBEE_TO_MCU: Top (U8.3), Main_MCU (U11.30)

## Assembly variants
Main: not fitted R21_1 R21_2 R21_3 R22_1 R22_2 R22_3